# Altium project PixelClockController.PrjPCB
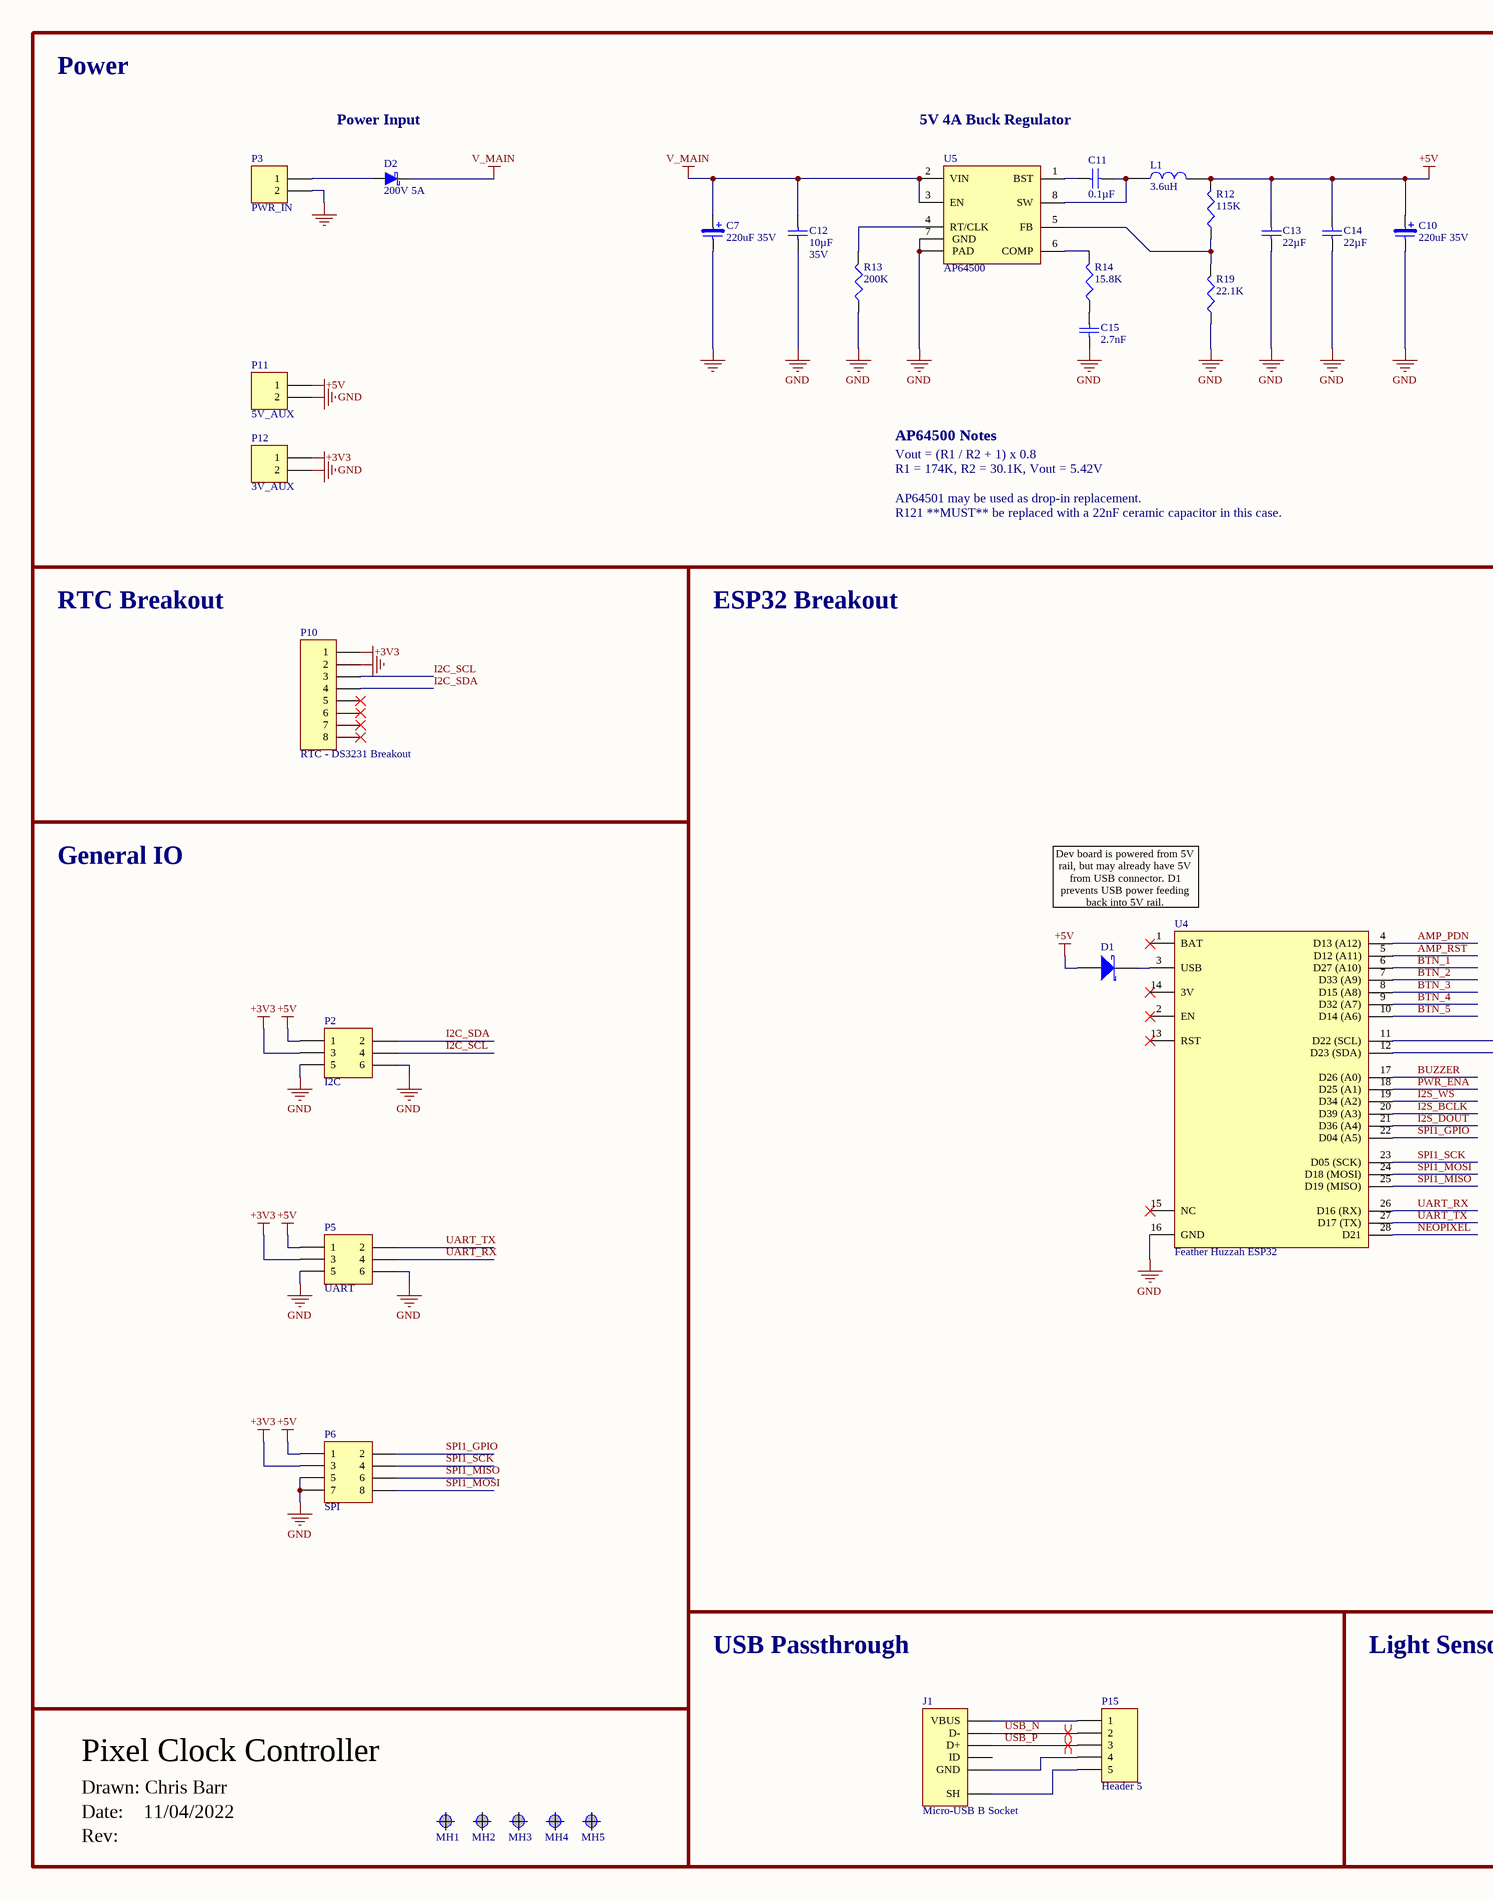
[diagram p0: PixelClockController.SchDoc, left]
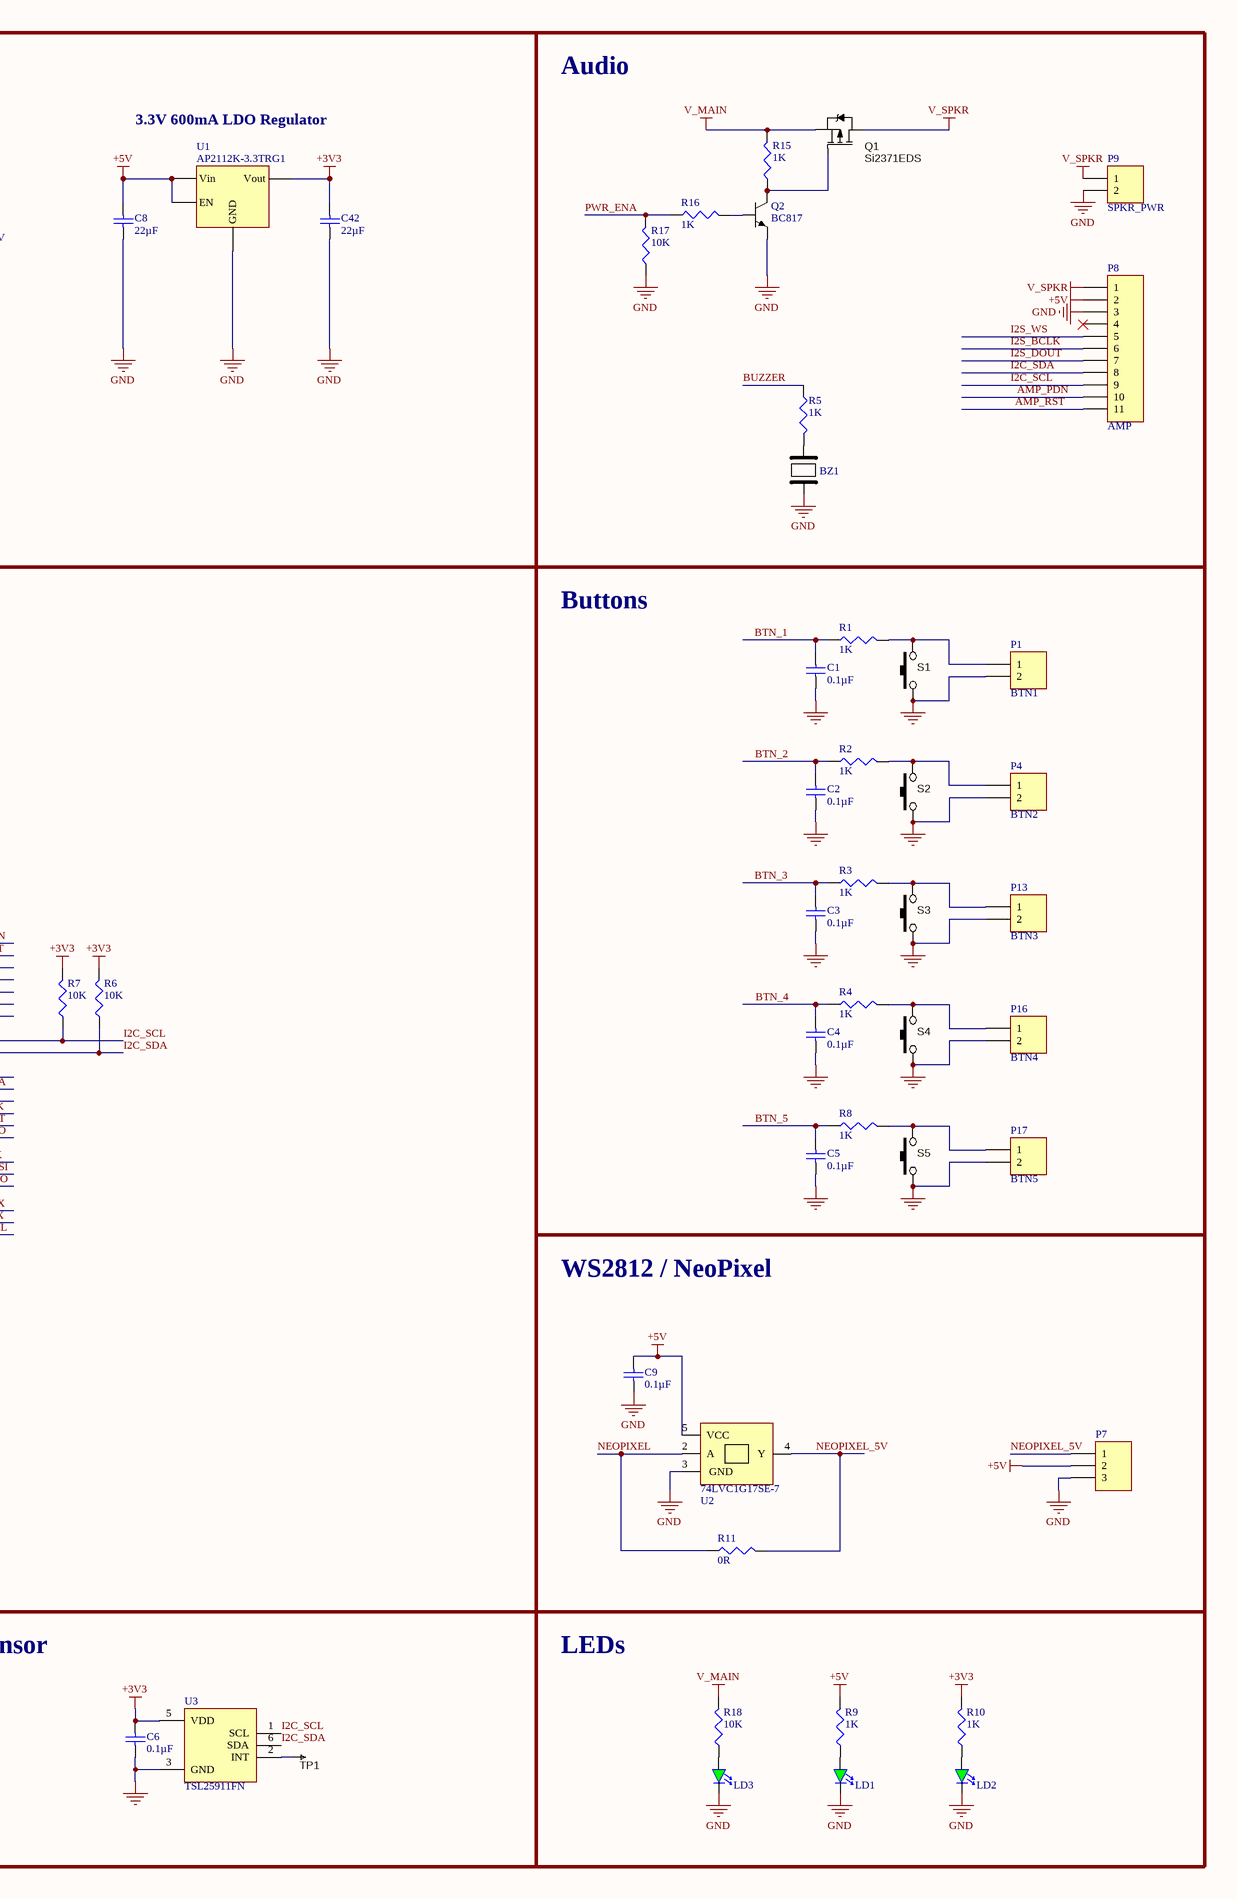
[diagram p1: PixelClockController.SchDoc, right]
ProjectVersionString: v1.0B; ProjectOutputVersion: v1_0B; ProjectName: V3D_EnvCheck
1 sheet, 77 parts. Net scope: global (net labels, ports and power ports of the same name join across sheets).
Board file: PixelClockController.PcbDoc

## Sheet PixelClockController.SchDoc
size A2; PageSetup: Record=PageOptions|CenterHorizontal=True|CenterVertical=True|PrintScale=0.68|XCorrection=1.00|YCorrection=1.00|PrintKind=1|BorderSize=5000000|LeftOffset=0|BottomOffset=0|Orientation=2|PaperLength=1000|PaperWidth=1000|Scale=100|PaperSource=7|PrintQuality=-4|MediaType=1|DitherType=10|PrintScaleMode=1|PaperKind=A3

### Parts
BZ1  Piezo Transducer  [PKMCS0909E4000-R1]  (value not drawn)
C1  value 0.1µF  [CAPC1608X90N]  (hidden comment: Capacitor)
C2  value 0.1µF  [CAPC1608X90N]  (hidden comment: Capacitor)
C3  value 0.1µF  [CAPC1608X90N]  (hidden comment: Capacitor)
C4  value 0.1µF  [CAPC1608X90N]  (hidden comment: Capacitor)
C5  value 0.1µF  [CAPC1608X90N]  (hidden comment: Capacitor)
C6  value 0.1µF  [CAPC1608X90N]  (hidden comment: Capacitor)
C7  value 220uF 35V  [CAPAE250P680X1220_VERT]  (hidden comment: CapE-8.0-THT-220uF-35V)
C8  value 22µF  [CAPC3216X100N]  (hidden comment: Capacitor)
C9  value 0.1µF  [CAPC1608X90N]  (hidden comment: Capacitor)
C10  value 220uF 35V  [CAPAE250P680X1220_VERT]  (hidden comment: CapE-8.0-THT-220uF-35V)
C11  value 0.1µF  [CAPC1608X90N]  (hidden comment: Capacitor)
C12  value 10µF  Voltage: 35V  [CAPC3225X220N]  (hidden comment: Capacitor)
C13  value 22µF  [CAPC3216X100N]  (hidden comment: Capacitor)
C14  value 22µF  [CAPC3216X100N]  (hidden comment: Capacitor)
C15  value 2.7nF  [CAPC1608X90N]  (hidden comment: Capacitor)
C42  value 22µF  [CAPC3216X100N]  (hidden comment: Capacitor)
D1  (no value)  [DIOM2616X08N]
D2  value 200V 5A  [DO-214AA]  (hidden comment: Diode SK520BTR)
J1  Micro-USB B Socket  [USB3131-XX-0230-X_revB]
L1  value 3.6uH  [INDUCTOR_NR8040]  (hidden comment: Inductor SMD 3.6uH 4.9A)
LD1  LEDG  0603  [LED 1608-0603]  (value not drawn)
LD2  LEDG  0603  [LED 1608-0603]  (value not drawn)
LD3  LEDG  0603  [LED 1608-0603]  (value not drawn)
MH1  Screw Hole  [M3-Hole-2]  (value not drawn)  (no BOM)
MH2  Screw Hole  [M3-Hole-2]  (value not drawn)  (no BOM)
MH3  Screw Hole  [M3-Hole-2]  (value not drawn)  (no BOM)
MH4  Screw Hole  [M3-Hole-2]  (value not drawn)  (no BOM)
MH5  Screw Hole  [M3-Hole-2]  (value not drawn)  (no BOM)
P1  BTN1  [HDR1X2-HEADER]  (no BOM)
P2  I2C  [HDR2X3-Header]  (no BOM)
P3  PWR_IN  [HDR1X2-HEADER]  (no BOM)
P4  BTN2  [HDR1X2-HEADER]  (no BOM)
P5  UART  [HDR2X3-Header]  (no BOM)
P6  SPI  [HDR2X4-HEADER]  (no BOM)
P7  Header 3  [HDR1X3-HEADER]  (value not drawn)  (no BOM)
P8  AMP  [HDR1X11]  (no BOM)
P9  SPKR_PWR  [HDR1X2-HEADER]  (no BOM)
P10  RTC - DS3231 Breakout  [HDR1X8-HEADER]  (no BOM)
P11  5V_AUX  [HDR1X2-HEADER]  (no BOM)
P12  3V_AUX  [HDR1X2-HEADER]  (no BOM)
P13  BTN3  [HDR1X2-HEADER]  (no BOM)
P15  Header 5  [HDR1X5]  (no BOM)
P16  BTN4  [HDR1X2-HEADER]  (no BOM)
P17  BTN5  [HDR1X2-HEADER]  (no BOM)
Q1  Si2371EDS  [SOT23-3 New]
Q2  BC817  [SOT23-3 New]
R1  value 1K  [RES 1608-0603]  (hidden comment: Resistor)
R2  value 1K  [RES 1608-0603]  (hidden comment: Resistor)
R3  value 1K  [RES 1608-0603]  (hidden comment: Resistor)
R4  value 1K  [RES 1608-0603]  (hidden comment: Resistor)
R5  value 1K  [RES 1608-0603]  (hidden comment: Resistor)
R6  value 10K  [RES 1608-0603]  (hidden comment: Resistor)
R7  value 10K  [RES 1608-0603]  (hidden comment: Resistor)
R8  value 1K  [RES 1608-0603]  (hidden comment: Resistor)
R9  value 1K  [RES 1608-0603]  (hidden comment: Resistor)
R10  value 1K  [RES 1608-0603]  (hidden comment: Resistor)
R11  value 0R  [RES 1608-0603]  (hidden comment: Res-0603-0R)
R12  value 115K  [RES 1608-0603]  (hidden comment: Resistor)
R13  value 200K  [RES 1608-0603]  (hidden comment: Resistor)
R14  value 15.8K  [RES 1608-0603]  (hidden comment: Resistor)
R15  value 1K  [RES 1608-0603]  (hidden comment: Resistor)
R16  value 1K  [RES 1608-0603]  (hidden comment: Resistor)
R17  value 10K  [RES 1608-0603]  (hidden comment: Resistor)
R18  value 10K  [RES 1608-0603]  (hidden comment: Resistor)
R19  value 22.1K  [RES 1608-0603]  (hidden comment: Resistor)
S1  SW_THT_PB_4.3mm  [TACT-SWITCH-TS1143]  (value not drawn)
S2  SW_THT_PB_4.3mm  [TACT-SWITCH-TS1143]  (value not drawn)
S3  SW_THT_PB_4.3mm  [TACT-SWITCH-TS1143]  (value not drawn)
S4  SW_THT_PB_4.3mm  [TACT-SWITCH-TS1143]  (value not drawn)
S5  SW_THT_PB_4.3mm  [TACT-SWITCH-TS1143]  (value not drawn)
TP1  TESTPOINT  [TP-R60]  (value not drawn)  (no BOM)
U1  AP2112K-3.3TRG1  [SOT23-5]
U2  74LVC1G17SE-7  [SOT353]
U3  TSL25911FN  [SON65P200X70-6N]
U4  Feather Huzzah ESP32  [Adafruit Feather Huzzah ESP32]
U5  AP64500  [SOIC127P600X140_HS-9N]

### Blocks framed on the sheet
Power: C7 C8 C10-C15 C42 D2 L1 P3 P11 P12 R12-R14 R19 U1 U5
Audio: BZ1 P8 P9 Q1 Q2 R5 R15-R17
General IO: P2 P5 P6
RTC Breakout: P10
ESP32 Breakout: D1 R6 R7 U4
Buttons: C1-C5 P1 P4 P13 P16 P17 R1-R4 R8 S1-S5
WS2812 / NeoPixel: C9 P7 R11 U2
USB Passthrough: J1 P15
Light Sensor: C6 TP1 U3
LEDs: LD1-LD3 R9 R10 R18
Pixel Clock Controller: MH1-MH5

### Nets
+3V3: C6.2 C42.2 P2.3 P5.3 P6.3 P10.1 P12.1 R6.2 R7.2 R10.2 U1.5(Vout) U3.5(VDD)
+5V: C8.2 C9.2 C10.1 C13.2 C14.2 D1.A L1.2 P2.1 P5.1 P6.1 P7.2 P8.2 P11.1 R9.2 R12.2 U1.1(Vin) U1.3(EN) U2.5(VCC)
GND: BZ1.2 C1.1 C2.1 C3.1 C4.1 C5.1 C6.1 C7.2 C8.1 C9.1 C10.2 C12.1 C13.1 C14.1 C15.1 C42.1 LD1.2(K) LD2.2(K) LD3.2(K) P1.2 P2.5 P2.6 P3.2 P4.2 P5.5 P5.6 P6.5 P6.7 P7.3 P8.3 P9.2 P10.2 P11.2 P12.2 P13.2 P16.2 P17.2 Q2.2(E) R13.1 R17.1 R19.1 S1.2 S2.2 S3.2 S4.2 S5.2 U1.2(GND) U2.3(GND) U3.3(GND) U4.16(GND) U5.7(GND) U5.9(PAD)
V_MAIN: C7.1 C12.2 D2.K Q1.2(S) R15.2 R18.2 U5.2(VIN) U5.3(EN)
V_SPKR: P8.1 P9.1 Q1.3(D)
AMP_PDN: P8.10 U4.4(D13_(A12))
AMP_RST: P8.11 U4.5(D12_(A11))
BTN_1: C1.2 R1.2 U4.6(D27_(A10))
BTN_2: C2.2 R2.2 U4.7(D33_(A9))
BTN_3: C3.2 R3.2 U4.8(D15_(A8))
BTN_4: C4.2 R4.2 U4.9(D32_(A7))
BTN_5: C5.2 R8.2 U4.10(D14_(A6))
BUZZER: R5.1 U4.17(D26_(A0))
I2C_SCL: P2.4 P8.9 P10.3 R7.1 U3.1(SCL) U4.11(D22_(SCL))
I2C_SDA: P2.2 P8.8 P10.4 R6.1 U3.6(SDA) U4.12(D23_(SDA))
I2S_BCLK: P8.6 U4.20(D39_(A3))
I2S_DOUT: P8.7 U4.21(D36_(A4))
I2S_WS: P8.5 U4.19(D34_(A2))
NEOPIXEL: R11.1 U2.2(A) U4.28(D21)
NEOPIXEL_5V: P7.1 R11.2 U2.4(Y)
PWR_ENA: R16.1 R17.2 U4.18(D25_(A1))
SPI1_GPIO: P6.2 U4.22(D04_(A5))
SPI1_MISO: P6.6 U4.25(D19_(MISO))
SPI1_MOSI: P6.8 U4.24(D18_(MOSI))
SPI1_SCK: P6.4 U4.23(D05_(SCK))
UART_RX: P5.4 U4.26(D16_(RX))
UART_TX: P5.2 U4.27(D17_(TX))
USB_N: J1.2(D-) P15.2
USB_P: J1.3(D+) P15.3
NetBZ1_1: BZ1.1 R5.2
NetC11_1: C11.1 L1.1 U5.8(SW)
NetC11_2: C11.2 U5.1(BST)
NetC15_2: C15.2 R14.1
NetD1_K: D1.K U4.3(USB)
NetD2_A: D2.A P3.1
NetJ1_1: J1.1(VBUS) P15.1
NetJ1_5: J1.5(GND) P15.4
NetJ1_S: J1.S(SH) P15.5
NetLD1_1: LD1.1(A) R9.1
NetLD2_1: LD2.1(A) R10.1
NetLD3_1: LD3.1(A) R18.1
NetP1_1: P1.1 R1.1 S1.1
NetP4_1: P4.1 R2.1 S2.1
NetP13_1: P13.1 R3.1 S3.1
NetP16_1: P16.1 R4.1 S4.1
NetP17_1: P17.1 R8.1 S5.1
NetQ1_1: Q1.1(G) Q2.3(C) R15.1
NetQ2_1: Q2.1(B) R16.2
NetR12_1: R12.1 R19.2 U5.5(FB)
NetR13_2: R13.2 U5.4(RT/CLK)
NetR14_2: R14.2 U5.6(COMP)
NetTP1_1: TP1.1 U3.2(INT)

Not connected (* = marked no-connect by the designer): J1 4(ID); MH1 M3(0); MH2 M3(0); MH3 M3(0); MH4 M3(0); MH5 M3(0); P8 4*; P10 5* 6* 7* 8*; U4 1(BAT)* 2(EN)* 13(RST)* 14(3V)* 15(NC)*

### Layout directives
differential pair: USB_N, USB_P

### Notes on the sheet
- Power Input
- 5V 4A Buck Regulator
- 3.3V 600mA LDO Regulator
- AP64500 Notes
- Vout = (R1 / R2 + 1) x 0.8
  R1 = 174K, R2 = 30.1K, Vout = 5.42V
  AP64501 may be used as drop-in replacement.
  R121 **MUST** be replaced with a 22nF ceramic capacitor in this case.
- (near U4) Dev board is powered from 5V rail, but may already have 5V from USB connector. D1 prevents USB power feeding back into 5V rail.
- Drawn: Chris Barr
- Date:    11/04/2022
- Rev:
- Title
- Size:
- Date:
- File:
- A1
- Number:
- Time:
- Revision:
- Sheet
- of

### Library data of the parts
BZ1 = Piezo Transducer: AUDIO PIEZO TRANSDUCER 12.5V SMD 9 x 9MM; Supplier 1: Digi-Key; Supplier Part Number 1: 490-9647-1-ND
C1-C6 C9 C11 = UMJ107BB7104KAHT: CAP CER 0.1UF 50V X7R 0603; Manufacturer 1: Taiyo Yuden; Note: Approved sub OK; Tolerance: ±10%; Type: X5R; Revision: July-2002: Re-released for DXP Platform.; Voltage: 50V; Supplier 1: Digi-Key; Supplier Part Number 1: 587-4474-1-ND; Package: 0402; Manufacturer Part Number 1: UMJ107BB7104KAHT; Temperature Coefficient: X7R; Operating Temperature: -55°C ~ 125°C; Package / Case: 0603 (1608 Metric); Size / Dimension: 0.063" L x 0.031" W (1.60mm x 0.80mm); Thickness (Max): 0.039" (1.00mm)
C7 C10 = CapE-8.0-THT-220uF-35V: CAP ALUM 220UF 20% 35V RADIAL; Note: Approved sub OK; Published: 8-Jun-2000; Revision: July-2002: Re-released for DXP Platform.; Publisher: Altium Limited; Supplier 1: Digi-Key; Supplier Part Number 1: 732-8946-1-ND
C8 C13 C14 C42 = EMK316ABJ226KL-T: CAP CER 22UF 16V X5R 1206; Manufacturer 1: Taiyo Yuden; Note: Approved sub OK; Tolerance: ±10%; Revision: July-2002: Re-released for DXP Platform.; Voltage: 16V; Supplier 1: Digi-Key; Supplier Part Number 1: 587-5521-1-ND; Package: 0402; Type: X5R; Manufacturer Part Number 1: EMK316ABJ226KL-T; Temperature Coefficient: X5R; Operating Temperature: -55°C ~ 85°C; Package / Case: 1206 (3216 Metric); Size / Dimension: 0.126" L x 0.063" W (3.20mm x 1.60mm); Thickness (Max): 0.071" (1.80mm)
C12 = GMJ325KB7106KMHP: CAP CER 10UF 35V X7R 1210; Manufacturer 1: Taiyo Yuden; Note: Approved sub OK; Tolerance: ±10%; Type: X5R; Revision: July-2002: Re-released for DXP Platform.; Package: 0402; Supplier 1: Digi-Key; Supplier Part Number 1: 587-4890-1-ND; Manufacturer Part Number 1: GMJ325KB7106KMHP; Temperature Coefficient: X7R; Operating Temperature: -55°C ~ 125°C; Package / Case: 1210 (3225 Metric); Size / Dimension: 0.126" L x 0.098" W (3.20mm x 2.50mm); Thickness (Max): 0.110" (2.80mm)
C15 = C1608X7R2A222K080AE: CAP CER 2700PF 50V X7R 0603; Manufacturer 1: TDK Corporation; Voltage: 100V; Note: Approved sub OK; Tolerance: ±10%; Type: X5R; Revision: July-2002: Re-released for DXP Platform.; Supplier 1: Digi-Key; Supplier Part Number 1: 1292-1423-2-ND; Package: 0402; Manufacturer Part Number 1: C1608X7R2A222K080AE; Temperature Coefficient: X7R; Operating Temperature: -55°C ~ 125°C; Package / Case: 0603 (1608 Metric); Size / Dimension: 0.063" L x 0.031" W (1.60mm x 0.80mm); Thickness (Max): 0.035" (0.90mm)
D1 = Diode Schottky 2A 40V (SS24FL): DIODE SCHOTTKY 40V 2A SOD123F; Manufacturer 1: ON Semiconductor; Manufacturer Part Number 1: SS24FL; Code - JEDEC: SOD-123F; Note: Approved sub OK; Published: 8-Jun-2000; Revision: July-2002: Re-released for DXP Platform.; Publisher: Altium Limited; Supplier 1: Digi-Key; Supplier Part Number 1: SS24FLCT-ND
D2 = Diode SK520BTR: DIODE SCHOTTKY 200V 5A SMB; Code - JEDEC: DO-214-AB; Published: 8-Jun-2000; Revision: July-2002: Re-released for DXP Platform.; Publisher: Altium Limited; Supplier 1: Digi-Key; Supplier Part Number 1: 1655-1602-1-ND
J1 = Micro-USB B Socket Vertical: MICRO B SKT, VERTICAL, TH, 30",; Note: Approved sub OK; Supplier 1: Digi-Key; Supplier Part Number 1: 2073-USB3131-30-0230-ACT-ND
L1 = Inductor SMD 3.6uH 4.9A: FIXED IND 3.6UH 4.9A 19.5 MOHM; Published: 24-Mar-1999; Revision: July-2002: Re-released for DXP Platform.; Publisher: Altium Limited; Supplier 1: Digi-Key; Supplier Part Number 1: 587-1998-1-ND
LD1-LD3 = LEDG  0603: LED GREEN CLEAR CHIP SMD 0603; Note: Approved sub OK; Supplier 1: Digi-Key; Supplier Part Number 1: 160-1435-2-ND
P1 P3 P4 P9 P11-P13 P16 P17 = Header 1X2: Header, 2-Pin; Manufacturer 1: Generic Header; Note: Approved sub OK
P2 P5 = Header 2X3: Header, 3-Pin, Dual row; Manufacturer 1: Generic Header; Note: Approved sub OK
P6 = Header 2X4: Header, 4-Pin, Dual row; Manufacturer 1: Generic Header; Note: Approved sub OK
P7 = Header 1X3: Header, 3-Pin; Manufacturer 1: Generic Header; Note: Approved sub OK
P8 = Header 11: Header, 11-Pin; LatestRevisionDate: 17-Jul-2002; LatestRevisionNote: Re-released for DXP Platform.; Publisher: Altium Limited
P10 = Header 1X8: Header, 8-Pin; Manufacturer 1: Generic Header; Note: Approved sub OK
P15 = Header 5: Header, 5-Pin; LatestRevisionDate: 17-Jul-2002; LatestRevisionNote: Re-released for DXP Platform.; Publisher: Altium Limited
Q1 = MOSFET - Si2371EDS: MOSFET SMD P-CH 30V 4.8A SOT-23-3; FET Type: MOSFET P-Channel, Metal Oxide; Supplier 1: Digi-Key; Supplier Part Number 1: SI2371EDS-T1-GE3CT-ND
Q2 = Transistor - NPN - 45V 500MA - BC817: TRANS NPN 45V 500MA TO236AB; Supplier 1: Digi-Key; Supplier Part Number 1: 1727-6186-1-ND
R1-R5 R8-R10 R15 R16 = RC0603FR-071KL: RES SMD 1K OHM 1% 1/10W 0603; Manufacturer 1: Yageo; Note: Approved sub OK; Power (Watts): 0.1W, 1/10W; Temperature Coefficient: ±100ppm/°C; Published: 8-Jun-2000; Revision: July-2002: Re-released for DXP Platform.; Publisher: Altium Limited; Supplier 1: Digi-Key; Supplier Part Number 1: 311-1.00KHRCT-ND; Manufacturer Part Number 1: RC0603FR-071KL; Tolerance: ±1%; Composition: Thick Film; Features: Moisture Resistant; Operating Temperature: -55°C ~ 155°C; Package / Case: 0603 (1608 Metric); Size / Dimension: 0.063" L x 0.031" W (1.60mm x 0.80mm); Height - Seated (Max): 0.022" (0.55mm)
R6 R7 R17 R18 = RC0603FR-0710KL: RES SMD 10K OHM 1% 1/10W 0603; Manufacturer 1: Yageo; Note: Approved sub OK; Power (Watts): 0.1W, 1/10W; Temperature Coefficient: ±100ppm/°C; Published: 8-Jun-2000; Revision: July-2002: Re-released for DXP Platform.; Publisher: Altium Limited; Supplier 1: Digi-Key; Supplier Part Number 1: 311-10.0KHRCT-ND; Manufacturer Part Number 1: RC0603FR-0710KL; Tolerance: ±1%; Composition: Thick Film; Features: Moisture Resistant; Operating Temperature: -55°C ~ 155°C; Package / Case: 0603 (1608 Metric); Size / Dimension: 0.063" L x 0.031" W (1.60mm x 0.80mm); Height - Seated (Max): 0.022" (0.55mm)
R11 = Res-0603-0R: RES 0 OHM JUMPER 1/10W 0603; Note: Approved sub OK; Published: 8-Jun-2000; Revision: July-2002: Re-released for DXP Platform.; Publisher: Altium Limited; Supplier 1: Digi-Key; Supplier Part Number 1: 311-0.0GRCT-ND
R12 = RC0603FR-07115KL: RES SMD 115K OHM 1% 1/10W 0603; Manufacturer 1: Yageo; Note: Approved sub OK; Power (Watts): 0.1W, 1/10W; Temperature Coefficient: ±100ppm/°C; Published: 8-Jun-2000; Revision: July-2002: Re-released for DXP Platform.; Publisher: Altium Limited; Supplier 1: Digi-Key; Supplier Part Number 1: 311-115KHRCT-ND; Manufacturer Part Number 1: RC0603FR-07115KL; Tolerance: ±1%; Composition: Thick Film; Features: Moisture Resistant; Operating Temperature: -55°C ~ 155°C; Package / Case: 0603 (1608 Metric); Size / Dimension: 0.063" L x 0.031" W (1.60mm x 0.80mm); Height - Seated (Max): 0.022" (0.55mm)
R13 = RC0603FR-07200KL: RES SMD 200K OHM 1% 1/10W 0603; Manufacturer 1: Yageo; Note: Approved sub OK; Power (Watts): 0.1W, 1/10W; Temperature Coefficient: ±100ppm/°C; Published: 8-Jun-2000; Revision: July-2002: Re-released for DXP Platform.; Publisher: Altium Limited; Supplier 1: Digi-Key; Supplier Part Number 1: 311-200KHRCT-ND; Manufacturer Part Number 1: RC0603FR-07200KL; Tolerance: ±1%; Composition: Thick Film; Features: Moisture Resistant; Operating Temperature: -55°C ~ 155°C; Package / Case: 0603 (1608 Metric); Size / Dimension: 0.063" L x 0.031" W (1.60mm x 0.80mm); Height - Seated (Max): 0.022" (0.55mm)
R14 = RC0603FR-0715K8L: RES SMD 15.8K OHM 1% 1/10W 0603; Manufacturer 1: Yageo; Note: Approved sub OK; Power (Watts): 0.1W, 1/10W; Temperature Coefficient: ±100ppm/°C; Published: 8-Jun-2000; Revision: July-2002: Re-released for DXP Platform.; Publisher: Altium Limited; Supplier 1: Digi-Key; Supplier Part Number 1: 311-15.8KHRCT-ND; Manufacturer Part Number 1: RC0603FR-0715K8L; Tolerance: ±1%; Composition: Thick Film; Features: Moisture Resistant; Operating Temperature: -55°C ~ 155°C; Package / Case: 0603 (1608 Metric); Size / Dimension: 0.063" L x 0.031" W (1.60mm x 0.80mm); Height - Seated (Max): 0.022" (0.55mm)
R19 = RC0603FR-0722K1L: RES SMD 22.1K OHM 1% 1/10W 0603; Manufacturer 1: Yageo; Note: Approved sub OK; Power (Watts): 0.1W, 1/10W; Temperature Coefficient: ±100ppm/°C; Published: 8-Jun-2000; Revision: July-2002: Re-released for DXP Platform.; Publisher: Altium Limited; Supplier 1: Digi-Key; Supplier Part Number 1: 311-22.1KHRCT-ND; Manufacturer Part Number 1: RC0603FR-0722K1L; Tolerance: ±1%; Composition: Thick Film; Features: Moisture Resistant; Operating Temperature: -55°C ~ 155°C; Package / Case: 0603 (1608 Metric); Size / Dimension: 0.063" L x 0.031" W (1.60mm x 0.80mm); Height - Seated (Max): 0.022" (0.55mm)
S1-S5 = SW_THT_PB_4.3mm: 6 X 6 MM, 12 MM ACTUATOR HEIGHT; Manufacturer 1: CUI Devices; Manufacturer Part Number 1: TS02-66-120-BK-160-LCR-D; Package / Case: 6.5x6.5mm; 4.3mm stem; Material: Brass/Nylon/Ag plating; Supplier 1: Digi-Key; Supplier Part Number 1: 2223-TS02-66-120-BK-160-LCR-D-ND
TP1 = TESTPOINT: SMD test pin
U1 = Regulator - AP2112K 3.3V Linear Regulator: IC REG LINEAR 3.3V 600MA SOT25; Manufacturer 1: Diodes Incorporated; Supplier 1: Digi-Key; Supplier Part Number 1: AP2112K-3.3TRG1DICT-ND; Manufacturer Part Number 1: AP2112K-3.3TRG1
U2 = Buffer Non-Inverting Schmitt Trigger 74LVC1G17SE-7: IC BUF NON-INVERT 5.5V SOT353; Supplier 1: Digi-Key; Supplier Part Number 1: 74LVC1G17SE-7CT-ND
U3 = IC - Optical Sensor Ambient - I²C 6-WFDFN: SENSOR OPT AMBIENT 6DFN; Supplier 1: Digi-Key; Supplier Part Number 1: TSL25911FNCT-ND
U4 = Adafruit Feather - ESP32 Huzzah
U5 = Regulator - AP64500 Buck Regulator: IC DCDC CONV HV BUCK SO-8EP; Supplier 1: Digi-Key; Supplier Part Number 1: 31-AP64500SP-13CT-ND